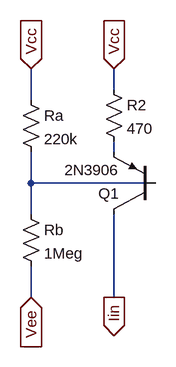
[diagram p0: schematic current_supply.asc]
current_supply.asc, the LTspice schematic file:
Version 4
SHEET 1 880 680
WIRE 256 0 256 -32
WIRE 128 16 128 -32
WIRE 256 96 256 80
WIRE 128 144 128 96
WIRE 320 144 128 144
WIRE 128 192 128 144
WIRE 128 320 128 272
WIRE 256 320 256 192
FLAG 256 -32 Vcc
IOPIN 256 -32 In
FLAG 128 -32 Vcc
IOPIN 128 -32 In
FLAG 256 320 Iin
IOPIN 256 320 Out
FLAG 128 320 Vee
IOPIN 128 320 In
SYMBOL res 240 -16 R0
SYMATTR InstName R2
SYMATTR Value 470
SYMBOL res 112 176 R0
SYMATTR InstName Rb
SYMATTR Value 1Meg
SYMBOL res 112 0 R0
SYMATTR InstName Ra
SYMATTR Value 220k
SYMBOL pnp 320 192 R180
SYMATTR InstName Q1
SYMATTR Value 2N3906

The netlist it stands for:
* current_supply.asc
R2 Vcc N001 470
Rb N002 Vee 1Meg
Ra Vcc N002 220k
Q1 Iin N002 N001 0 2N3906
.model NPN NPN
.model PNP PNP
.lib standard.bjt
.backanno
.end